# Altium schematic sheet nm_usb.SchDoc: =GlobalProjectName
size 209 x 297 mm; SheetNumber: 6; SheetTotal: 9; PageSetup: Record=PageOptions|CenterHorizontal=True|CenterVertical=True|PrintScale=1.00|XCorrection=1.00|YCorrection=1.00|PrintKind=1|BorderSize=5000000|LeftOffset=0|BottomOffset=0|Orientation=2|PaperLength=1000|PaperWidth=1000|Scale=100|PaperSource=15|PrintQuality=1200|MediaType=1|DitherType=10|PaperKind=A3|PrintScaleMode=1; Weight: -; ScaleFactor: -
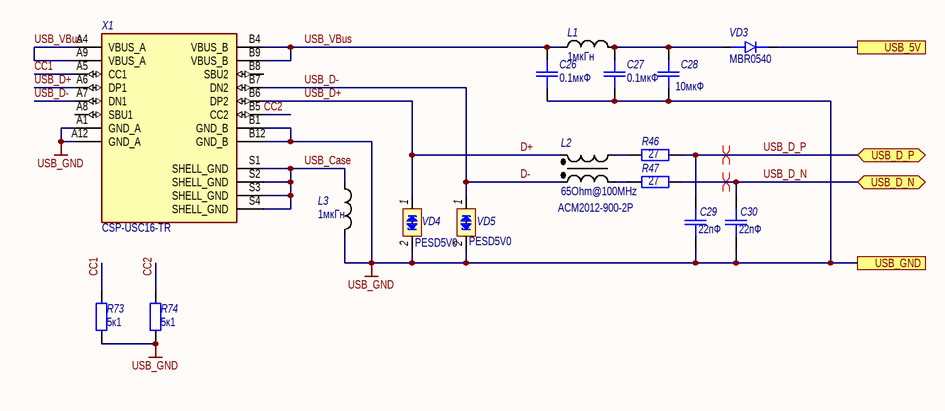
[diagram p0: nm_usb.SchDoc]

## Parts
C26  0.1мкФ  [SMD_C0603]
C27  0.1мкФ  [SMD_C0603]
C28  10мкФ  [SMD_C0603]
C29  value 22пФ  [SMD_C0603]  (hidden comment: K10-79)
C30  value 22пФ  [SMD_C0603]  (hidden comment: K10-79)
L1  value 1мкГн  [SMD_0805]  (hidden comment: Inductor)
L2  65Ohm@100MHz  Наименование: ACM2012-900-2P  [ACM2012]
L3  value 1мкГн  [SMD_0805]  (hidden comment: Inductor)
R46  value 27  [SMD_0603]  (hidden comment: OSM R1-8)
R47  value 27  [SMD_0603]  (hidden comment: OSM R1-8)
R73  value 5к1  [SMD_0603]  (hidden comment: OSM R1-8)
R74  value 5к1  [SMD_0603]  (hidden comment: OSM R1-8)
VD3  MBR0540  [SOD-123]
VD4  PESD5V0  [SOD-323]
VD5  PESD5V0  [SOD-323]
X1  CSP-USC16-TR  [VALCON_CSP-USC16-TR]

## Ports
USB_5V, USB_D_N (bidir), USB_D_P (bidir), USB_GND

## Nets
USB_GND: C26.1 C27.1 C28.1 C29.1 C30.1 L3.2 R73.2 R74.1 VD4.2(cathode_2) VD5.2(cathode_2) X1.A1(GND_A) X1.A12(GND_A) X1.B1(GND_B) X1.B12(GND_B) ; port USB_GND
D+: L2.3 VD4.1(cathode_1) X1.A6(DP1) X1.B6(DP2)  [also labelled USB_D+]
D-: L2.2 VD5.1(cathode_1) X1.A7(DN1) X1.B7(DN2)  [also labelled USB_D-]
USB_5V: VD3.1(Cathode) ; port USB_5V
USB_Case: L3.1 X1.S1(SHELL_GND) X1.S2(SHELL_GND) X1.S3(SHELL_GND) X1.S4(SHELL_GND)
USB_D_N: C30.2 R47.2 ; port USB_D_N
USB_D_P: C29.2 R46.2 ; port USB_D_P
USB_VBus: C26.2 L1.1 X1.A4(VBUS_A) X1.A9(VBUS_A) X1.B4(VBUS_B) X1.B9(VBUS_B)
СС1: R73.1 X1.A5(CC1)
СС2: R74.2 X1.B5(CC2)
NetC27_2: C27.2 C28.2 L1.2 VD3.2(Anode)
NetL2_1: L2.1 R47.1
NetL2_4: L2.4 R46.1

Not connected (* = marked no-connect by the designer): X1 A8(SBU1) B8(SBU2)

## Layout directives
differential pair: USB_D_N, USB_D_P

## Notes on the sheet
- Подп. и дата
- Инв. № дубл.
- Взам. инв. №
- Инв. № подл.
- Изм.
- Лист
- № докум.
- Подп.
- Дата
- Форма 2а ГОСТ 2.104-2006
- Копировал
- Формат А4

## Library data of the parts
C26-C28 = Capacitor: Назначение: SMD-конденсатор; Наименование: Конденсатор; Потребление, Вт: 0; Place_v1: *; Place_v2: *
  C26 C27: Value: 0.1мкФ
  C28: Value: 10мкФ
C29 C30 = Capacitor: Назначение: SMD-конденсатор; Наименование: Конденсатор; Потребление, Вт: 0; Точность: %; Напряжение: В; Диэлектрик: *; Place_v1: *; Place_v2: *
L1 L3 = Inductor: Наименование: Индуктивность; Назначение: SMD-индуктивность; Потребление, Вт: 0,010; Place_v1: *; Place_v2: *
L2 = Inductor_coupled: Coupled inductor; Назначение: Связанная индуктивность; Потребление, Вт: 0,1; Value: 65Ohm@100MHz; Place_v1: *; Place_v2: *
R46 R47 R73 R74 = Resistor: Наименование: Резистор; Назначение: SMD-резистор; Потребление, Вт: 0,001; Точность: %; Place_v1: *; Place_v2: *
VD3 = MBR0540: Schottky diode; Назначение: Диод шотки; Потребление, Вт: 0,001; Наименование: MBR0540
VD4 VD5 = PESDxL1BA: Low capacitance bidirectional ESD protection diodes; Назначение: ESD защитные диоды; Потребление, Вт: 0.0; Наименование: PESD5V0S1BA; ComponentLink1Description: DataSheet; ComponentLink1URL: https://static.chipdip.ru/lib/635/DOC005635911.pdf; Place_v1: *; Place_v2: *
X1 = CSP-USC16-TR: CSP-USC16-TR Valcon USB Type C Surface Mount PCB Socket; Назначение: SMD соединитель USB type C; Потребление, Вт: 0; Package: None; Purchase-URL: https://pricing.snapeda.com/search/part/CSP-USC16-TR/?ref=eda; MP: CSP-USC16-TR; Check_prices: https://www.snapeda.com/parts/CSP-USC16-TR/Valcon/view-part/4783629/?ref=eda; MF: Valcon; Value: *; Availability: No availability data; Price: None; SnapEDA_Link: https://www.snapeda.com/parts/CSP-USC16-TR/Valcon/view-part/4783629/?ref=snap; Наименование: CSP-USC16-TR; Place_v1: *; Place_v2: *